# Altium project DC power suply.PrjPcb
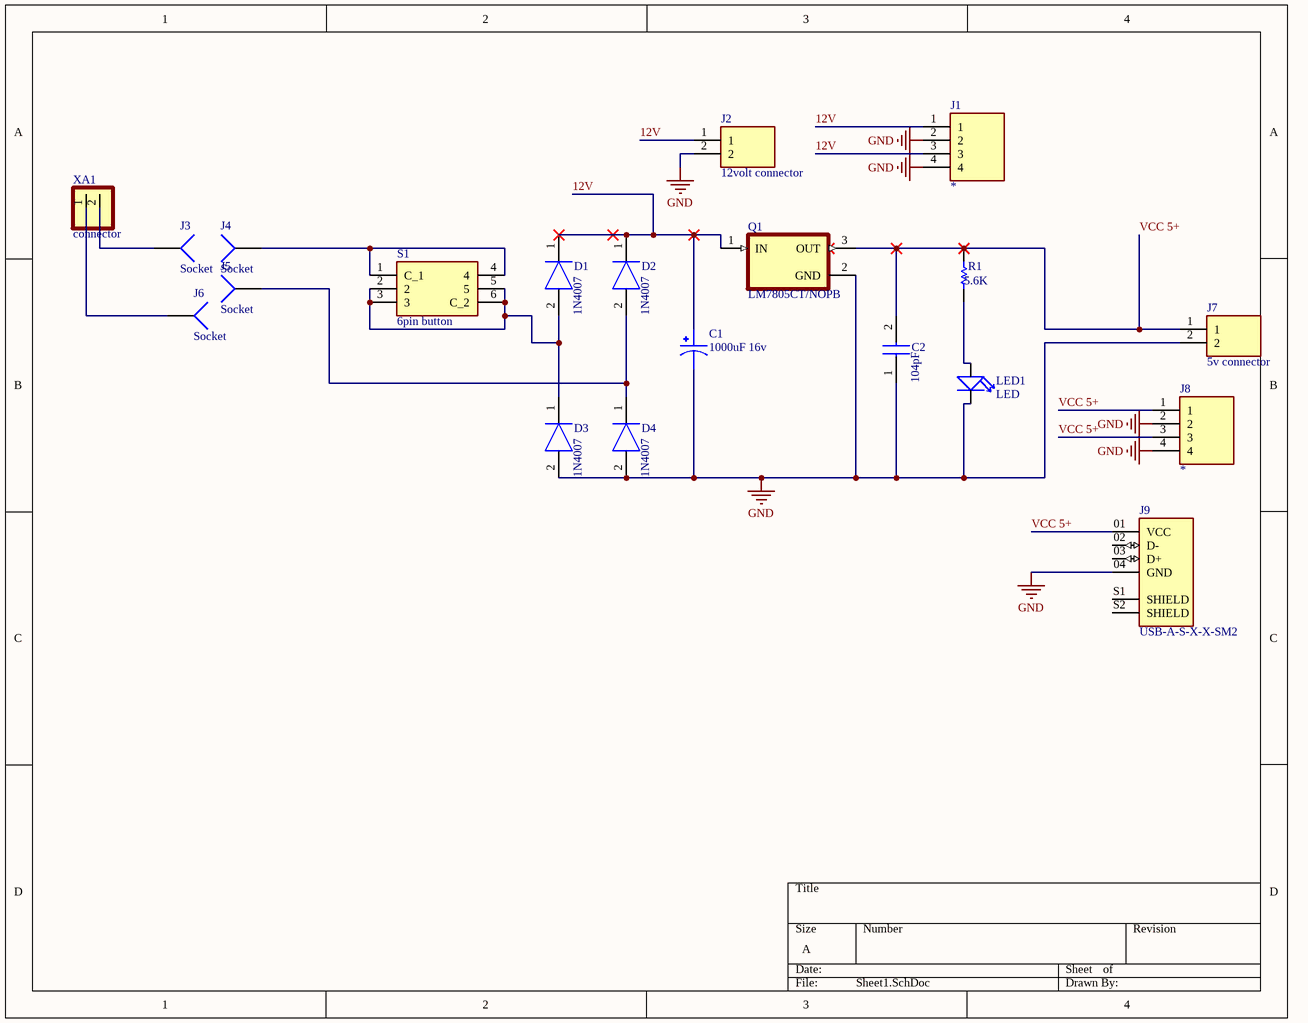
[diagram p0: Sheet1.SchDoc]
1 sheet, 20 parts. Net scope: global (net labels, ports and power ports of the same name join across sheets).
Board file: PCB1.PcbDoc

## Sheet Sheet1.SchDoc
size A

### Parts
C1  1000uF 16v  [CAPPRD500W60D1330H2700]
C2  104pF  [B32520C3104K000]
D1  1N4007  [DIOAD1138W56L406D183]
D2  1N4007  [DIOAD1138W56L406D183]
D3  1N4007  [DIOAD1138W56L406D183]
D4  1N4007  [DIOAD1138W56L406D183]
J1  282825-4  [TE_282825-4]  (value not drawn)
J2  12volt connector  [JST_B2B-XH-A(LF)(SN)]
J3  Socket  [PIN1]
J4  Socket  [PIN1]
J5  Socket  [PIN1]
J6  Socket  [PIN1]
J7  5v connector  [JST_B2B-XH-A(LF)(SN)]
J8  282825-4  [TE_282825-4]  (value not drawn)
J9  USB-A-S-X-X-SM2  [SAMTEC_USB-A-S-X-X-SM2]
LED1  LED  [LED2-2.54-D10MM]
Q1  LM7805CT/NOPB  [TO254P1054X470X2600-3]
R1  value 5.6K  [AXIAL-0.5]
S1  6pin button  [MPSA22E080150]
XA1  connector  [PHOENIX_MKDS1/2-3.81]

### Nets
GND: C1.2 C2.1 D3.2(A) D4.2(A) J1.2 J1.4 J2.2 J7.2 J8.2 J8.4 J9.04(GND) LED1.NEG Q1.2(GND)
12V: C1.1 D1.1(K) D2.1(K) J1.1 J1.3 J2.1 Q1.1(IN)
VCC 5+: C2.2 J7.1 J8.1 J8.3 J9.01(VCC) Q1.3(OUT) R1.2
NetD1_2: D1.2(A) D3.1(K) S1.2 S1.3 S1.5 S1.6(C_2)
NetD2_2: D2.2(A) D4.1(K) J5.1
NetJ3_1: J3.1 XA1.2
NetJ4_1: J4.1 S1.1(C_1) S1.4
NetJ6_1: J6.1 XA1.1
NetLED1_POS: LED1.POS R1.1

Not connected (* = marked no-connect by the designer): J9 02(D-) 03(D+) S1(SHIELD) S2(SHIELD)

### Library data of the parts
C1 = 478CKS010M: 4700ÂµF 10V Aluminum Electrolytic Capacitors Radial, Can 98.8mOhm @ 120Hz 2000 Hrs @ 85Â°C; MF: Illinois Capacitor; MP: 478CKS010M; SnapEDA_Link: https://www.snapeda.com/parts/478CKS010M/Illinois%20Capacitor/view-part/2347563/?ref=snap; Price: None; Mouser-Purchase-URL: https://snapeda.com/shop?store=Mouser&id=2347563; Availability: Warning; Package: Radial Illinois Capacitor; Value: *
C2 = B32520C3104K000: Capacitor; Manufacturer_Name: TDK; Datasheet Link: https://datasheet.datasheetarchive.com/originals/dk/DKDS41/DSANUWW0037983.pdf; Height: 8.5mm; Manufacturer_Part_Number: B32520C3104K000; Arrow Part Number: B32520C3104K000; Arrow Price/Stock: https://www.arrow.com/en/products/b32520c3104k000/epcos-tdk
D1-D4 = 1N4678__DO35_: Diode; Manufacturer_Name: Microsemi Corporation; Manufacturer_Part_Number: 1N4678 (DO35); Datasheet Link: https://www.microsemi.com/document-portal/doc_download/5827-1n4678-4717-datasheet
J1 J8 = 282825-4: 14 Position Terminal Block Header, Male Pins, Shrouded _2 Side_ 0.200 _5.08mm_ Vertical Through Hole; MF: TE Connectivity; Package: None; Availability: Unavailable; SnapEDA_Link: https://www.snapeda.com/parts/282825-4/TE%20Connectivity%20AMP%20Connectors/view-part/2375878/?ref=snap; EU_RoHS_Compliance: Compliant; MP: 282825-4; Price: None; Value: *; TE_purchase_URL: https://www.te.com/usa-en/product-282825-4.html?te_bu=Cor&te_type=disp&te_campaign=seda_glo_cor-seda-global-disp-prtnr-fy19-seda-model-bom-cta_sma-317_1&elqCampaignId=32493; Comment_1: *
J2 J7 = B2B-XH-A(LF)(SN): Connector Header Through Hole 2 position 0.098 _2.50mm_; MP: B2B-XH-A_LF__SN_; MF: JST Sales; Price: None; Package: None; Value: *; Availability: Unavailable; SnapEDA_Link: https://www.snapeda.com/parts/B2B-XH-A%28LF%29%28SN%29/JST%20Sales%20America%20Inc./view-part/492310/?ref=snap
J9 = USB-A-S-X-X-SM2: USB-A (USB TYPE-A) USB 2.0 Receptacle Connector 4 Position Surface Mount, Right Angle; MP: USB-A-S-F-B-SM2; MF: Samtec; SnapEDA_Link: https://www.snapeda.com/parts/USB-A-S-F-B-SM2/Samtec%20Inc./view-part/937545/?ref=snap; Value: *; Availability: Unavailable; DigiKey-Purchase-URL: https://snapeda.com/shop?store=DigiKey&id=937545; Package: None; Toby_UK-Purchase-URL: https://snapeda.com/shop?store=Toby+UK&id=937545; Price: None
LED1 = DIP-LED-GREEN-VAPOROUS-GREEN-10MM(2P-D10MM): DIP LED Green-Vaporous Green-10mm; MF: Chengguangxing; MP: G1004DC; Package: None; Value: *; SnapEDA_Link: https://www.snapeda.com/parts/G1004DC/Chengguangxing/view-part/106403/?ref=snap; Availability: Unavailable; Price: None
Q1 = LM7805CT/NOPB: Linear Voltage Regulator IC 1 Output 1A TO-220-3; MF: ON Semiconductor; MP: LM7805CT; SnapEDA_Link: https://www.snapeda.com/parts/LM7805CT/ON%20Semiconductor/view-part/546231/?ref=snap; Price: None; Package: TO-220 ON Semiconductor; Value: *; Availability: Unavailable
R1 = Res Semi: Semiconductor Resistor; Published: 8-Jun-2000; LatestRevisionDate: 17-Jul-2002; LatestRevisionNote: Re-released for DXP Platform.; PackageReference: AXIAL-0.5; Publisher: Altium Limited; PackageDescription: Axial Device, Thru-Hole; 2 Leads; 0.5 in Pin Spacing
S1 = MPSA-22E08-0150: Switch; Manufacturer_Name: KNITTER-SWITCH; Datasheet Link: http://www.knitter-switch.com/eng/Series/17?search=MPSA-22E08-0150; Height: 8mm; Manufacturer_Part_Number: MPSA-22E08-0150
XA1 = MKDS1/2-3.81: 2 Position Wire to Board Terminal Block Horizontal with Board 0.150 _3.81mm_ Through Hole; MF: Phoenix Contact; Package: None; Price: None; SnapEDA_Link: https://www.snapeda.com/parts/MKDS%201/%202-3.81/Phoenix%20Contact/view-part/114562/?ref=snap; Availability: Unavailable; Value: *; MP: MKDS 1/ 2-3.81
J3-J6 = Socket: LatestRevisionDate: 17-Jul-2002; LatestRevisionNote: Re-released for DXP Platform.; Publisher: Altium Limited